# Altium schematic sheet RGB2LVDS_DS90C385A.SchDoc
size A3
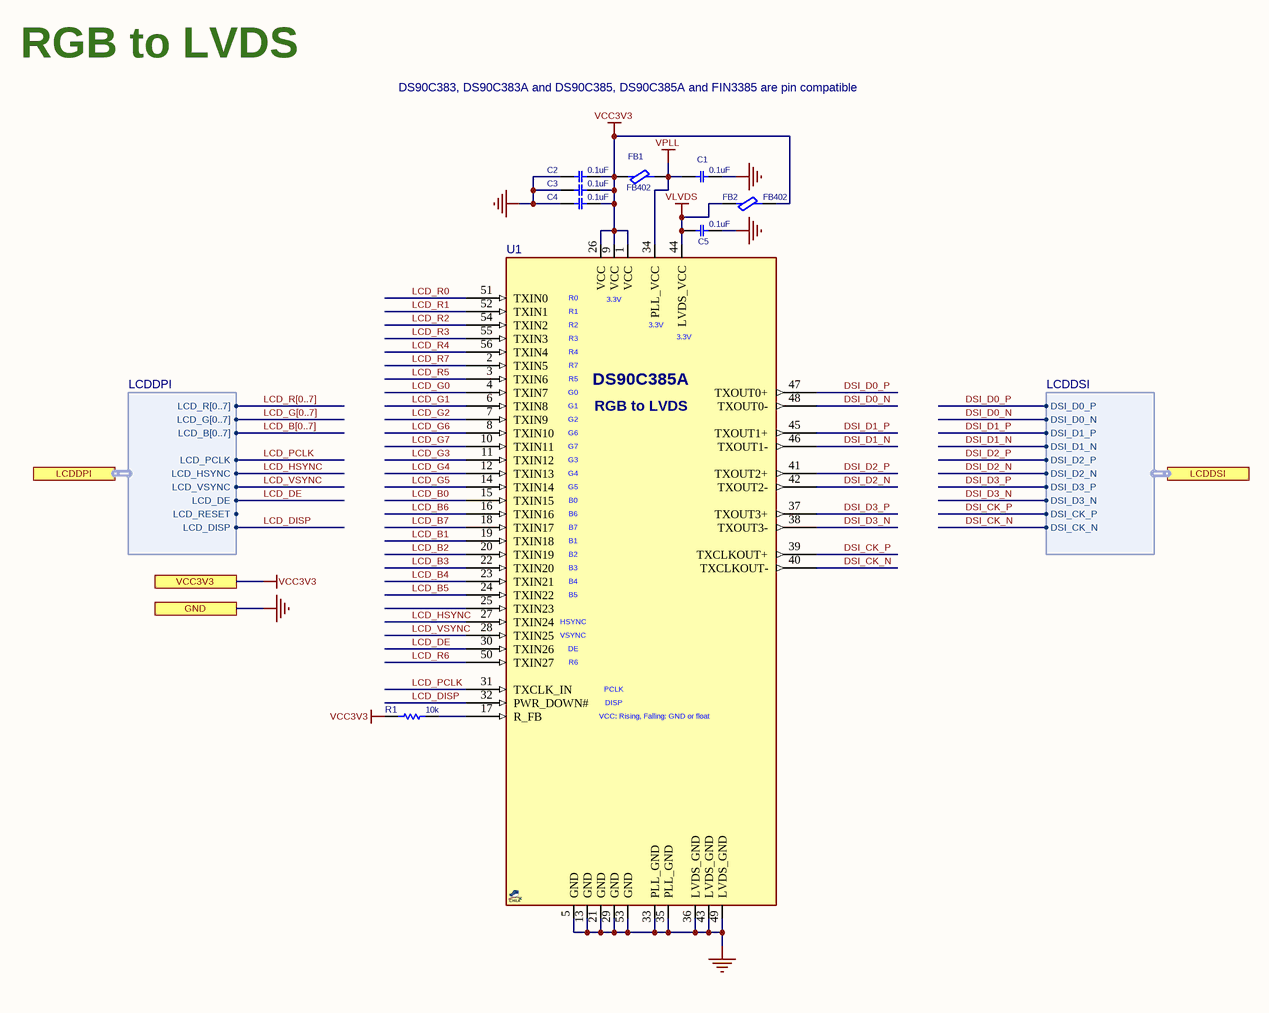
[diagram p0: RGB2LVDS_DS90C385A.SchDoc]

## Parts
C1  0.1uF  [C0402]
C2  0.1uF  [C0402]
C3  0.1uF  [C0402]
C4  0.1uF  [C0402]
C5  0.1uF  [C0402]
FB1  FB402  [L0402]
FB2  FB402  [L0402]
R1  10k  [R0402]
U1  DS90C385A  [SOG50_56]  (value not drawn)

## Ports
GND, LCDDPI (harness LCDDPI), LCDDSI (harness LCDDSI), VCC3V3

## Harnesses
LCDDPI: LCD_PCLK, LCD_HSYNC, LCD_VSYNC, LCD_DE, LCD_R[0..7], LCD_G[0..7], LCD_B[0..7], LCD_RESET, LCD_DISP
LCDDSI: DSI_D0_P, DSI_D0_N, DSI_D1_P, DSI_D1_N, DSI_D2_P, DSI_D2_N, DSI_D3_P, DSI_D3_N, DSI_CK_P, DSI_CK_N

## Nets
GND: C1.1 C2.2 C3.2 C4.2 C5.1 U1.5(GND) U1.13(GND) U1.21(GND) U1.29(GND) U1.33(PLL_GND) U1.35(PLL_GND) U1.36(LVDS_GND) U1.43(LVDS_GND) U1.49(LVDS_GND) U1.53(GND) ; port GND
VCC3V3: C2.1 C3.1 C4.1 FB1.1 FB2.2 R1.1 U1.1(VCC) U1.9(VCC) U1.26(VCC) ; port VCC3V3
VLVDS: C5.2 FB2.1 U1.44(LVDS_VCC)
VPLL: C1.2 FB1.2 U1.34(PLL_VCC)
DSI_CK_N: U1.40(TXCLKOUT-) ; port LCDDSI.DSI_CK_N
DSI_CK_P: U1.39(TXCLKOUT+) ; port LCDDSI.DSI_CK_P
DSI_D0_N: U1.48(TXOUT0-) ; port LCDDSI.DSI_D0_N
DSI_D0_P: U1.47(TXOUT0+) ; port LCDDSI.DSI_D0_P
DSI_D1_N: U1.46(TXOUT1-) ; port LCDDSI.DSI_D1_N
DSI_D1_P: U1.45(TXOUT1+) ; port LCDDSI.DSI_D1_P
DSI_D2_N: U1.42(TXOUT2-) ; port LCDDSI.DSI_D2_N
DSI_D2_P: U1.41(TXOUT2+) ; port LCDDSI.DSI_D2_P
DSI_D3_N: U1.38(TXOUT3-) ; port LCDDSI.DSI_D3_N
DSI_D3_P: U1.37(TXOUT3+) ; port LCDDSI.DSI_D3_P
LCD_B0: U1.15(TXIN15)
LCD_B1: U1.19(TXIN18)
LCD_B2: U1.20(TXIN19)
LCD_B3: U1.22(TXIN20)
LCD_B4: U1.23(TXIN21)
LCD_B5: U1.24(TXIN22)
LCD_B6: U1.16(TXIN16)
LCD_B7: U1.18(TXIN17)
LCD_DE: U1.30(TXIN26) ; port LCDDPI.LCD_DE
LCD_DISP: U1.32(PWR_DOWN#) ; port LCDDPI.LCD_DISP
LCD_G0: U1.4(TXIN7)
LCD_G1: U1.6(TXIN8)
LCD_G2: U1.7(TXIN9)
LCD_G3: U1.11(TXIN12)
LCD_G4: U1.12(TXIN13)
LCD_G5: U1.14(TXIN14)
LCD_G6: U1.8(TXIN10)
LCD_G7: U1.10(TXIN11)
LCD_HSYNC: U1.27(TXIN24) ; port LCDDPI.LCD_HSYNC
LCD_PCLK: U1.31(TXCLK_IN) ; port LCDDPI.LCD_PCLK
LCD_R0: U1.51(TXIN0)
LCD_R1: U1.52(TXIN1)
LCD_R2: U1.54(TXIN2)
LCD_R3: U1.55(TXIN3)
LCD_R4: U1.56(TXIN4)
LCD_R5: U1.3(TXIN6)
LCD_R6: U1.50(TXIN27)
LCD_R7: U1.2(TXIN5)
LCD_VSYNC: U1.28(TXIN25) ; port LCDDPI.LCD_VSYNC
NetR1_2: R1.2 U1.17(R_FB)

Not connected (* = marked no-connect by the designer): U1 25(TXIN23)

## Buses and harness runs
bus LCD_B[0..7]
bus LCD_G[0..7]
bus LCD_R[0..7]

## Notes on the sheet
- RGB to LVDS
- DS90C383, DS90C383A and DS90C385, DS90C385A and FIN3385 are pin compatible
- (in symbol DS90C385A_TSSOP56) R0; R1; R2; R3; R4; R7; R5; G0; G1; RGB to LVDS; G2; G6; G7; G3; G4; G5; B0; B6; B7; B1; B2; B3; B4; B5; HSYNC; VSYNC; DE; R6; PCLK; DISP; VCC: Rising, Falling: GND or float

## Library data of the parts
C1-C5 = CAP_SMD_MLCC: CAP, MLCC; PARAM: X7R, 10%, -55~125oC; MANF_P#: GRM155R71H104KE14D; MANF: Murata; PARAM2: 50v; PRICE: 100: 0.018$; ASSEMBLY: ASSEMBLY; VALUE: 0.1uF
FB1 FB2 = FBEAD_SMD_BLM15PD121: FERRITE_Bead, 0402, 0.5A, 200mOhm, 120@100MHz; MANF: MURATA; MANF_P#: BLM15AG121SN1D; PARAM: 120@100MHz; PARAM2: 0.5A, 200mOhm; VALUE: FB402
R1 = RES_SMD: RESISTOR, SMD; PARAM: 0.063W; DESC: DESCRIPTION; DIST#: MOUSER; PARAM2: 1%; MANF_P#: -; MANF: -; ASSEMBLY: ASSEMBLY; PRICE: 100= 0.3$; VALUE: 10k
U1 = DS90C385A_TSSOP56: RGB receiver, LVDS transmitter, 87.5MHz, 24-bit video inputs; MANF: Texas Instruments; MANF_P#: DS90C385AMT, DS90C385AMTX; PARAM2: 3.3V; PARAM: 87.5MHz, 24-bit; PRICE: 5$; VALUE: DS90C385A